# EasyEDA schematic 工训主板_2025-03-23.json
TITLE: Sheet_1; REV: 1.0; Date: 2024-09-17; Sheet: 1/1; Drawn By: iiaazz; Company: Your Company
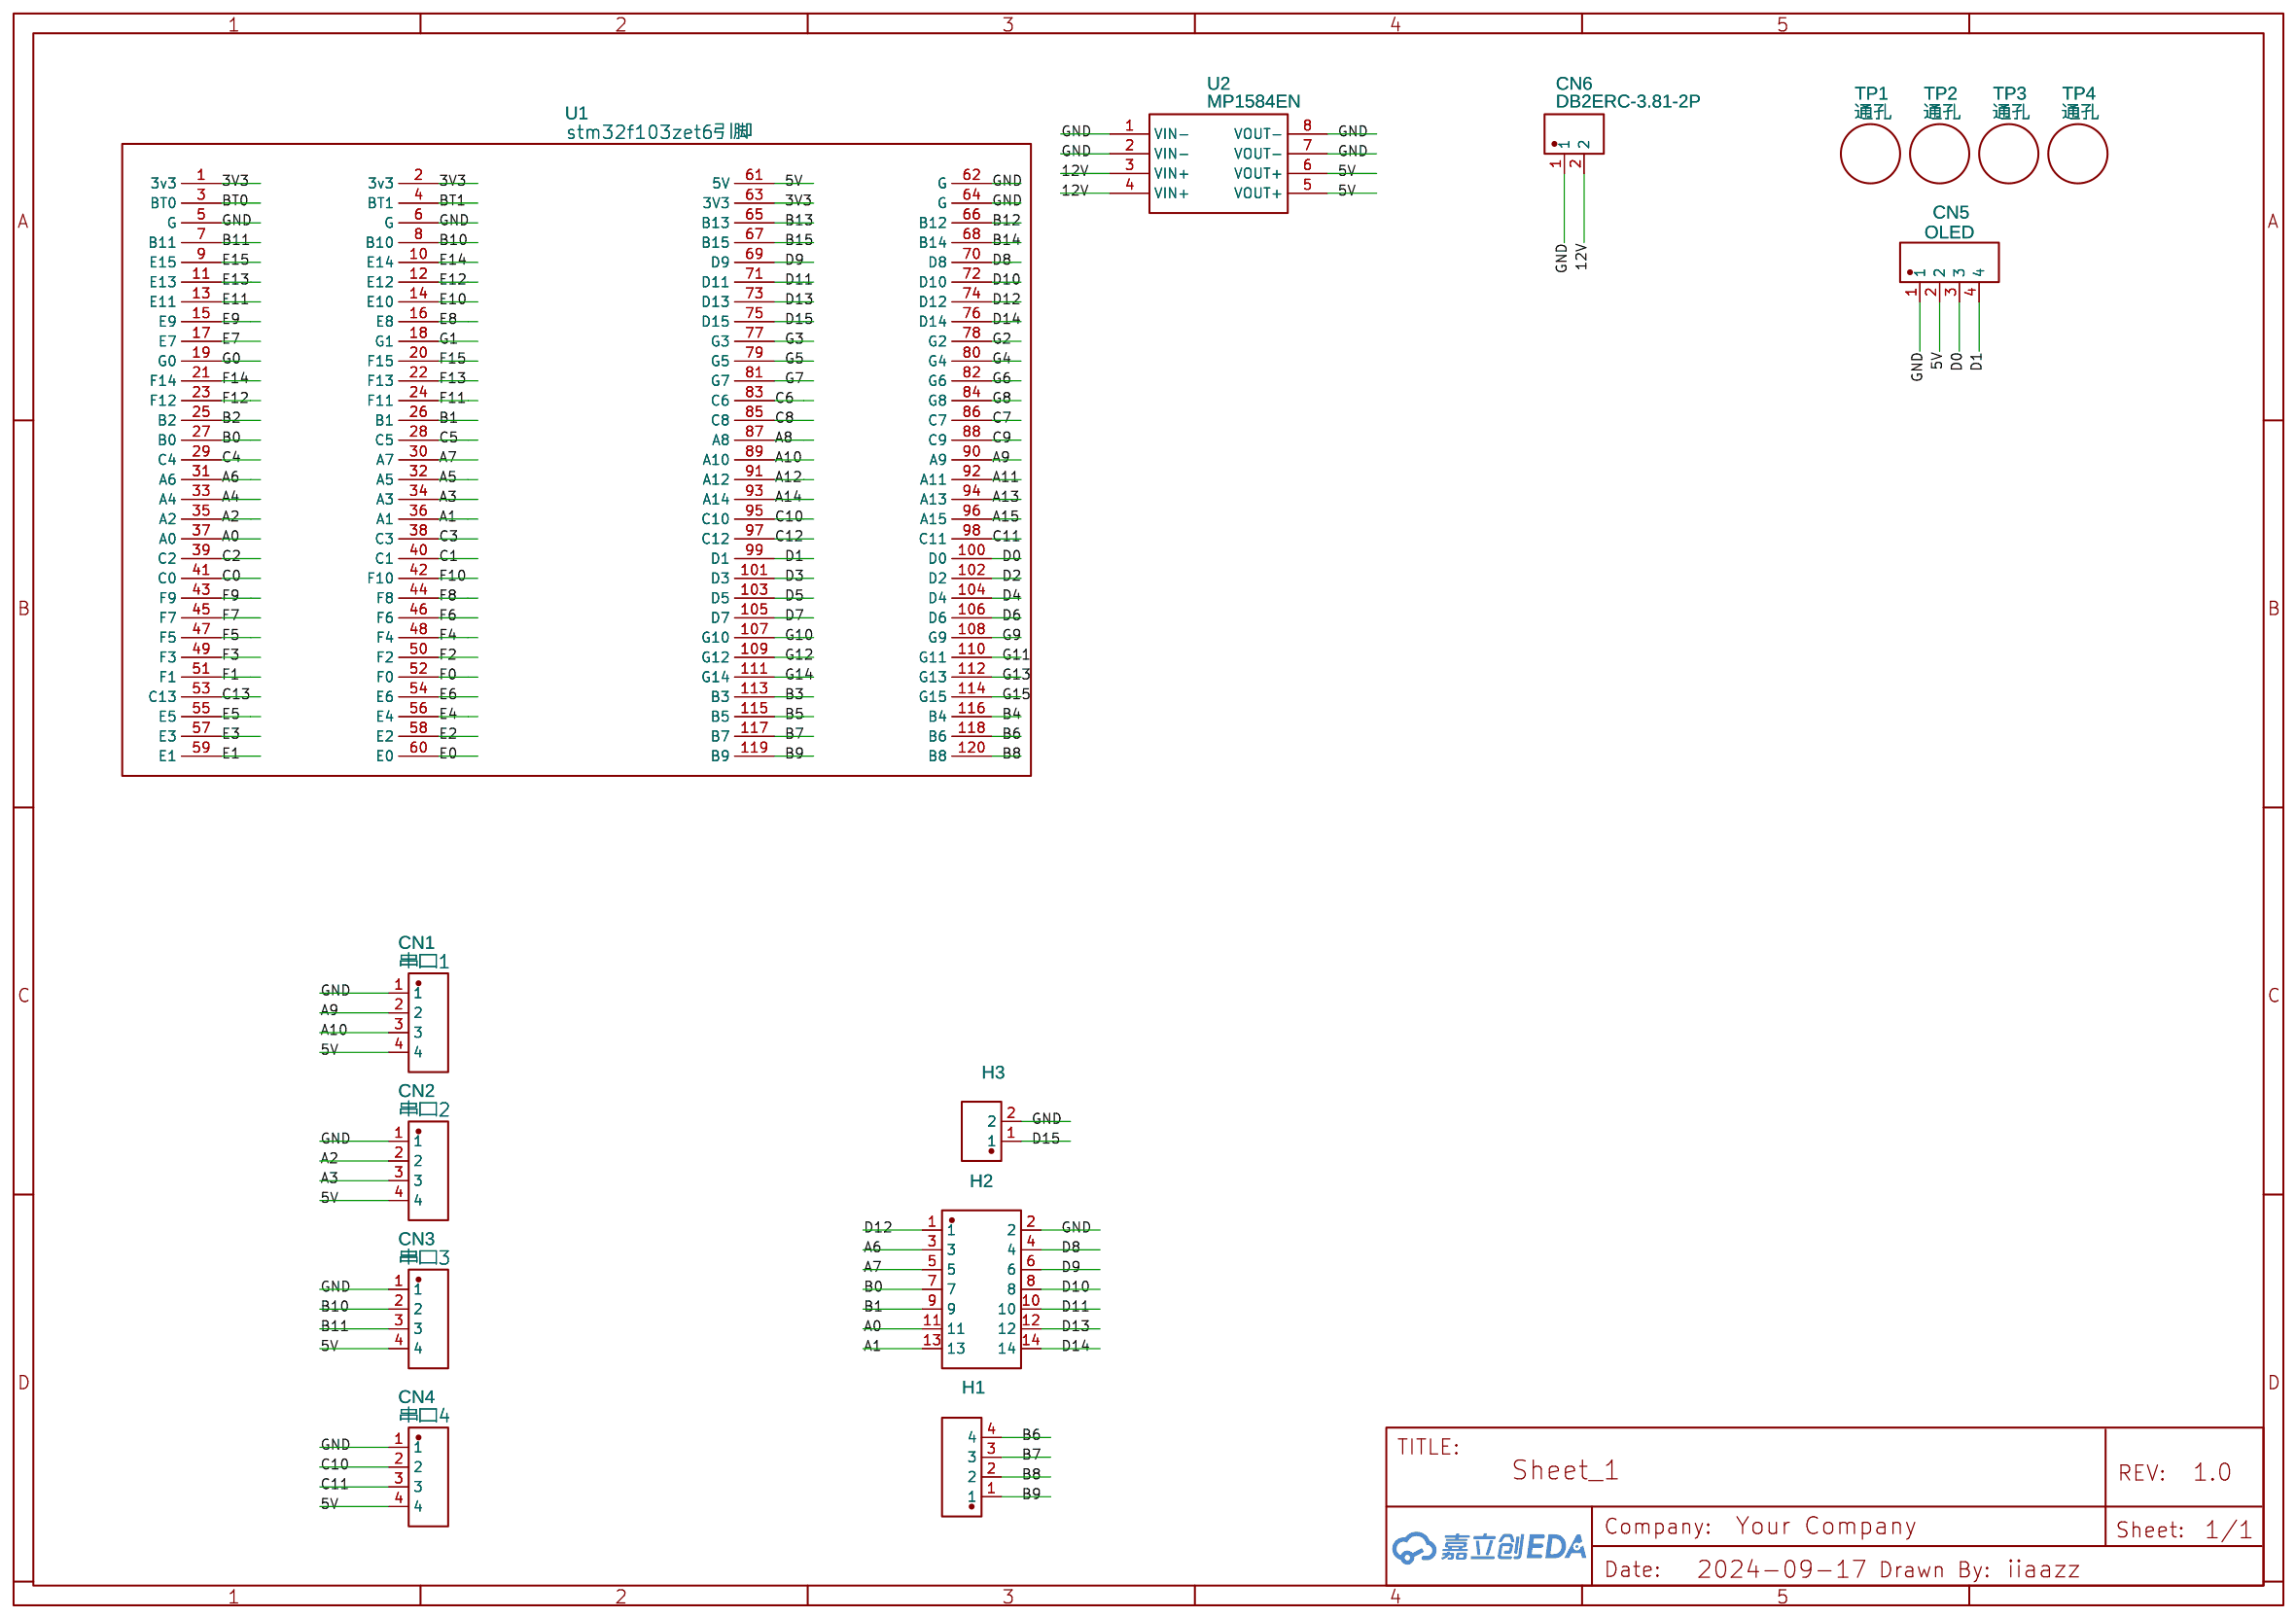
[diagram p0: schematic sheet]

## Parts
CN1  串口1  [CONN-TH_4P-P2.50_ZX-XH2.54-4PWZ]
CN2  串口2  [CONN-TH_4P-P2.50_ZX-XH2.54-4PWZ]
CN3  串口3  [CONN-TH_4P-P2.50_ZX-XH2.54-4PWZ]
CN4  串口4  [CONN-TH_4P-P2.50_ZX-XH2.54-4PWZ]
CN5  OLED  [CONN-TH_4P-P2.50_ZX-XH2.54-4PWZ]
CN6  DB2ERC-3.81-2P  [CONN-TH_2P-P3.81_DB2ERC-3.81-2P]
H1  PZ254V-11-04P_C2691448  [HDR-TH_4P-P2.54-V-M]
H2  PZ254V-12-14P  [HDR-TH_14P-P2.54-V-M-R2-C7-S2.54]
H3  PZ254V-11-02P  [HDR-TH_2P-P2.54-V-M]
TP1  通孔  [通孔]
TP2  通孔  [通孔]
TP3  通孔  [通孔]
TP4  通孔  [通孔]
U1  stm32f103zet6引脚  [STM32F103ZET]
U2  MP1584EN  [MP1584EN]

## Library data of the parts
CN1-CN5 = ZX-XH2.54-4PWZ: Contributor: lcsc; Supplier: LCSC; Supplier Part: C7429643; Manufacturer: Megastar(兆星); JLCPCB Part Class: Extended Part
CN6 = DB2ERC-3.81-2P: Contributor: LCSC; Supplier: LCSC; Supplier Part: C395684; Manufacturer: DORABO(地博电气); Manufacturer Part: DB2ERC-3.81-2P-GN; JLCPCB Part Class: Extended Part
H1 = PZ254V-11-04P_C2691448: Contributor: LCSC; Supplier: LCSC; Supplier Part: C2691448; Manufacturer: XFCN(兴飞); Manufacturer Part: PZ254V-11-04P; JLCPCB Part Class: Extended Part
H2 = PZ254V-12-14P: Contributor: LCSC; Supplier: LCSC; Supplier Part: C492424; Manufacturer: XFCN(兴飞); JLCPCB Part Class: Extended Part
H3 = PZ254V-11-02P: Contributor: LCSC; Supplier: LCSC; Supplier Part: C492401; Manufacturer: XFCN(兴飞); JLCPCB Part Class: Extended Part
TP1-TP4 = 通孔: Contributor: ssdhtc
U1 = stm32f103zet6引脚: Contributor: iiaazz
U2 = MP1584EN-LF-Z: Contributor: 1234455j

## Nets
3V3: U1.1(3v3) U1.2(3v3) U1.63(3V3)
5V: CN1.4 CN2.4 CN3.4 CN4.4 CN5.2 U1.61(5V) U2.5(VOUT+) U2.6(VOUT+)
12V: CN6.2 U2.3(VIN+) U2.4(VIN+)
GND: CN1.1 CN2.1 CN3.1 CN4.1 CN5.1 CN6.1 H2.2 H3.2 U1.5(G) U1.6(G) U1.62(G) U1.64(G) U2.1(VIN-) U2.2(VIN-) U2.7(VOUT-) U2.8(VOUT-)
A0: H2.11 U1.37(A0)
A1: H2.13 U1.36(A1)
A2: CN2.2 U1.35(A2)
A3: CN2.3 U1.34(A3)
A4: U1.33(A4)
A5: U1.32(A5)
A6: H2.3 U1.31(A6)
A7: H2.5 U1.30(A7)
A8: U1.87(A8)
A9: CN1.2 U1.90(A9)
A10: CN1.3 U1.89(A10)
A11: U1.92(A11)
A12: U1.91(A12)
A13: U1.94(A13)
A14: U1.93(A14)
A15: U1.96(A15)
B0: H2.7 U1.27(B0)
B1: H2.9 U1.26(B1)
B2: U1.25(B2)
B3: U1.113(B3)
B4: U1.116(B4)
B5: U1.115(B5)
B6: H1.4 U1.118(B6)
B7: H1.3 U1.117(B7)
B8: H1.2 U1.120(B8)
B9: H1.1 U1.119(B9)
B10: CN3.2 U1.8(B10)
B11: CN3.3 U1.7(B11)
B12: U1.66(B12)
B13: U1.65(B13)
B14: U1.68(B14)
B15: U1.67(B15)
BT0: U1.3(BT0)
BT1: U1.4(BT1)
C0: U1.41(C0)
C1: U1.40(C1)
C2: U1.39(C2)
C3: U1.38(C3)
C4: U1.29(C4)
C5: U1.28(C5)
C6: U1.83(C6)
C7: U1.86(C7)
C8: U1.85(C8)
C9: U1.88(C9)
C10: CN4.2 U1.95(C10)
C11: CN4.3 U1.98(C11)
C12: U1.97(C12)
C13: U1.53(C13)
D0: CN5.3 U1.100(D0)
D1: CN5.4 U1.99(D1)
D2: U1.102(D2)
D3: U1.101(D3)
D4: U1.104(D4)
D5: U1.103(D5)
D6: U1.106(D6)
D7: U1.105(D7)
D8: H2.4 U1.70(D8)
D9: H2.6 U1.69(D9)
D10: H2.8 U1.72(D10)
D11: H2.10 U1.71(D11)
D12: H2.1 U1.74(D12)
D13: H2.12 U1.73(D13)
D14: H2.14 U1.76(D14)
D15: H3.1 U1.75(D15)
E0: U1.60(E0)
E1: U1.59(E1)
E2: U1.58(E2)
E3: U1.57(E3)
E4: U1.56(E4)
E5: U1.55(E5)
E6: U1.54(E6)
E7: U1.17(E7)
E8: U1.16(E8)
E9: U1.15(E9)
E10: U1.14(E10)
E11: U1.13(E11)
E12: U1.12(E12)
E13: U1.11(E13)
E14: U1.10(E14)
E15: U1.9(E15)
F0: U1.52(F0)
F1: U1.51(F1)
F2: U1.50(F2)
F3: U1.49(F3)
F4: U1.48(F4)
F5: U1.47(F5)
F6: U1.46(F6)
F7: U1.45(F7)
F8: U1.44(F8)
F9: U1.43(F9)
F10: U1.42(F10)
F11: U1.24(F11)
F12: U1.23(F12)
F13: U1.22(F13)
F14: U1.21(F14)
F15: U1.20(F15)
G0: U1.19(G0)
G1: U1.18(G1)
G2: U1.78(G2)
G3: U1.77(G3)
G4: U1.80(G4)
G5: U1.79(G5)
G6: U1.82(G6)
G7: U1.81(G7)
G8: U1.84(G8)
G9: U1.108(G9)
G10: U1.107(G10)
G11: U1.110(G11)
G12: U1.109(G12)
G13: U1.112(G13)
G14: U1.111(G14)
G15: U1.114(G15)
